# EasyEDA Pro project MiNiProj.epro

# Schematic Schematic1
Board Name: Board1; Create Date: 2025-12-24; Page Name: P1; Project Name: New Project_2025-12-23_15-30-17; Schematic Name: Schematic1; Update Date: 2025-12-24; Company: EasyEDA.com; Page Size: A4; Version: V1.0
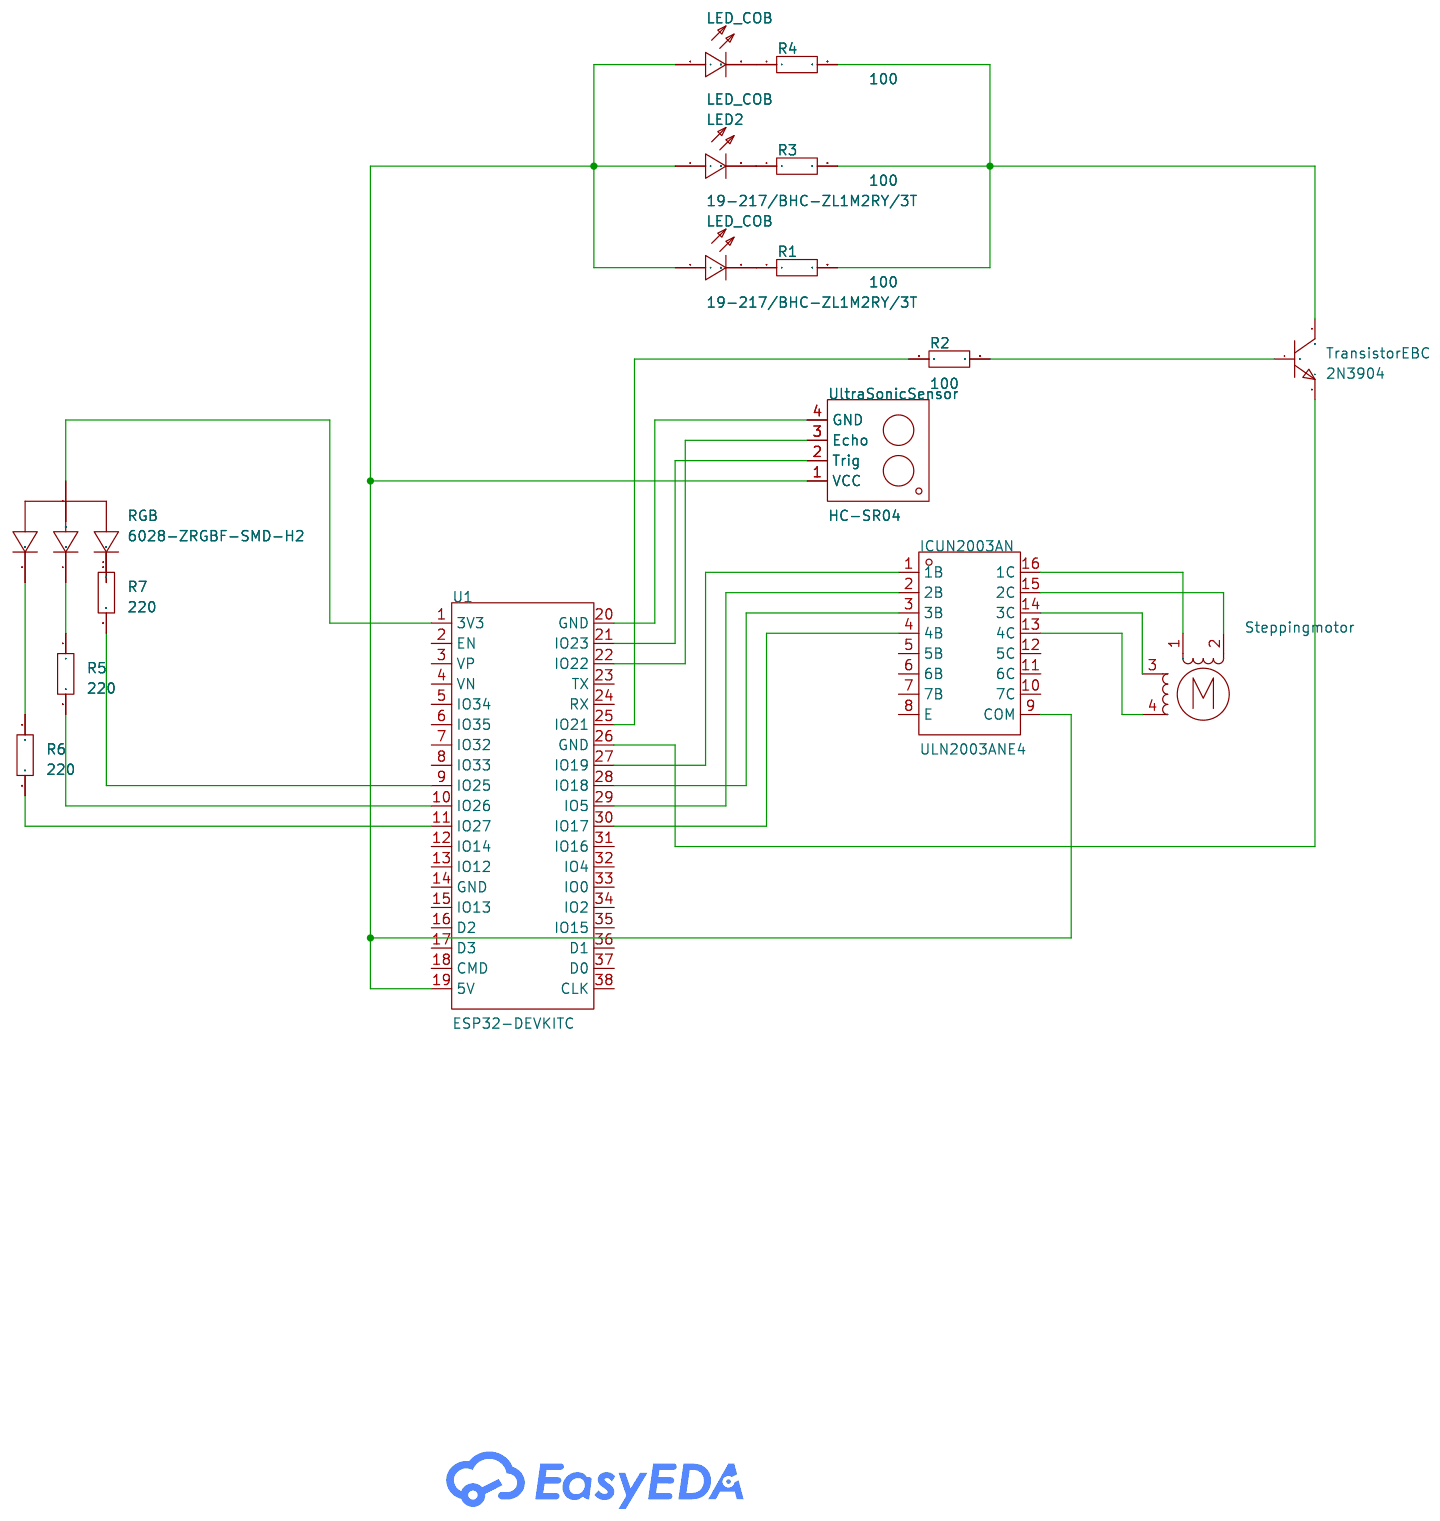
[diagram p0: schematic sheet]

## Parts
ICUN2003AN  ULN2003ANE4  [PDIP-16_L19.3-W6.4-P2.54-LS7.9-BL]
LED2  19-217/BHC-ZL1M2RY/3T
LED_COB  19-217/BHC-ZL1M2RY/3T
LED_COB#2  LED_COB
R1  100  [R0603]
R2  100  [R0603]
R3  100  [R0603]
R4  100  [R0603]
R5  220  [R0603]
R6  220  [R0603]
R7  220  [R0603]
RGB  6028-ZRGBF-SMD-H2  [LED-SMD_4P-L3.2-W2.8_ZRGBF-SMD-H2]
Steppingmotor  Stepper_Motor_bipolar
TransistorEBC  2N3904  [SOT-23-3_L2.9-W1.3-P1.90-LS2.4-BR]
U1  ESP32-DEVKITC  [BULETM-SMD_ESP32-DEVKITC]
UltraSonicSensor  HC-SR04

## Library data of the parts
ICUN2003AN = ULN2003ANE4: Supplier Part: C2879059; Manufacturer: TI(德州仪器); Supplier Footprint: PDIP-16; JLCPCB Part Class: Extended Part; Datasheet: https://www.ti.com/cn/lit/gpn/uln2003ai; Supplier: LCSC
LED2 LED_COB = LED: Supplier: LCSC; Manufacturer: EVERLIGHT; Supplier Part: C72041; JLCPCB Part Class: Basic Part
LED_COB#2 = LED: Supplier: LCSC; Manufacturer: EVERLIGHT; Manufacturer Part: 19-217/BHC-ZL1M2RY/3T; Supplier Part: C72041; JLCPCB Part Class: Basic Part
R1-R7 = Res_0603: Supplier Footprint: 0603
RGB = 6028-ZRGBF-SMD-H2: Supplier Part: C9900095081; Supplier Footprint: SMD-LED-6028-ZRGBF-SMD-H2; JLCPCB Part Class: Extended Part; Supplier: LCSC
Steppingmotor = Stepper_Motor_bipolar: User doc link: http://www.infineon.com/dgdl/Application-Note-TLE8110EE_driving_UniPolarStepperMotor_V1.1.pdf?fileId=db3a30431be39b97011be5d0aa0a00b0
TransistorEBC = Transistor SS8050: Transistor Type: Collector-Emitter Breakdown Voltage (Vceo): Collector Current (Ic): Power Dissipation (Pd): Collector Cut-Off Current (Icbo):100nA Collector-Emitter Saturation Voltage (VCE(sat)@Ic,Ib):500mV@800mA,80mA DC Current Gain (hFE@Ic,Vce):200@100; Collector Cut-Off Current (Icbo): 100nA; Collector-Emitter Saturation Voltage (VCE(sat)@Ic,Ib): 500mV@800mA,80mA; Datasheet: https://atta.szlcsc.com/upload/public/pdf/source/20140809/1457707209319.pdf; DC Current Gain (hFE@Ic,Vce): 200@100mA,1V; JLCPCB Part Class: Basic Part; LCSC Part Name: NPN 25V 1.5A; Manufacturer: CJ(江苏长电/长晶); Operating Temperature: +150℃@(Tj); Supplier: LCSC; Supplier Footprint: SOT-23-3; Supplier Part: C2150; Transition Frequency (fT): 100MHz
U1 = ESP32-DEVKITC-VE: Supplier Part: C20437001; Manufacturer: ESPRESSIF(乐鑫); JLCPCB Part Class: Extended Part; Datasheet: https://item.szlcsc.com/datasheet/ESP32-DEVKITC-VE/21775466.html; Supplier: LCSC
UltraSonicSensor = HC-SR04

## Nets
Net-(ICUN2003AN-1): ICUN2003AN.1(1B) U1.27(IO19)
Net-(ICUN2003AN-2): ICUN2003AN.2(2B) U1.29(IO5)
Net-(ICUN2003AN-3): ICUN2003AN.3(3B) U1.28(IO18)
Net-(ICUN2003AN-4): ICUN2003AN.4(4B) U1.30(IO17)
Net-(ICUN2003AN-9): ICUN2003AN.9(COM) LED2.1(A) LED_COB.1(A) LED_COB#2.1(A) U1.19(5V) UltraSonicSensor.1(VCC)
Net-(ICUN2003AN-13): ICUN2003AN.13(4C) Steppingmotor.4
Net-(ICUN2003AN-14): ICUN2003AN.14(3C) Steppingmotor.3
Net-(ICUN2003AN-15): ICUN2003AN.15(2C) Steppingmotor.2(-)
Net-(ICUN2003AN-16): ICUN2003AN.16(1C) Steppingmotor.1
Net-(LED2-2): LED2.2(C) R3.1
Net-(LED_COB#2-2): LED_COB#2.2(C) R4.1
Net-(LED_COB-2): LED_COB.2(C) R1.1
Net-(R1-2): R1.2 R3.2 R4.2 TransistorEBC.3(C)
Net-(R2-1): R2.1 U1.25(IO21)
Net-(R2-2): R2.2 TransistorEBC.1(B)
Net-(R5-1): R5.1 RGB.4(B)
Net-(R5-2): R5.2 U1.10(IO26)
Net-(R6-1): R6.1 RGB.1(R)
Net-(R6-2): R6.2 U1.11(IO27)
Net-(R7-1): R7.1 RGB.3(G)
Net-(R7-2): R7.2 U1.9(IO25)
Net-(RGB-2): RGB.2(COM+) U1.1(3V3)
Net-(TransistorEBC-2): TransistorEBC.2(E) U1.26(GND)
Net-(U1-20): U1.20(GND) UltraSonicSensor.4(GND)
Net-(U1-21): U1.21(IO23) UltraSonicSensor.2(Trig)
Net-(U1-22): U1.22(IO22) UltraSonicSensor.3(Echo)

Not connected (* = marked no-connect by the designer): ICUN2003AN 5(5B) 6(6B) 7(7B) 8(E) 10(7C) 11(6C) 12(5C); U1 2(EN) 3(VP) 4(VN) 5(IO34) 6(IO35) 7(IO32) 8(IO33) 12(IO14) 13(IO12) 14(GND) 15(IO13) 16(D2) 17(D3) 18(CMD) 23(TX) 24(RX) 31(IO16) 32(IO4) 33(IO0) 34(IO2) 35(IO15) 36(D1) 37(D0) 38(CLK)
